# Altium project Telliskivi2014MainBoard.PrjPcb
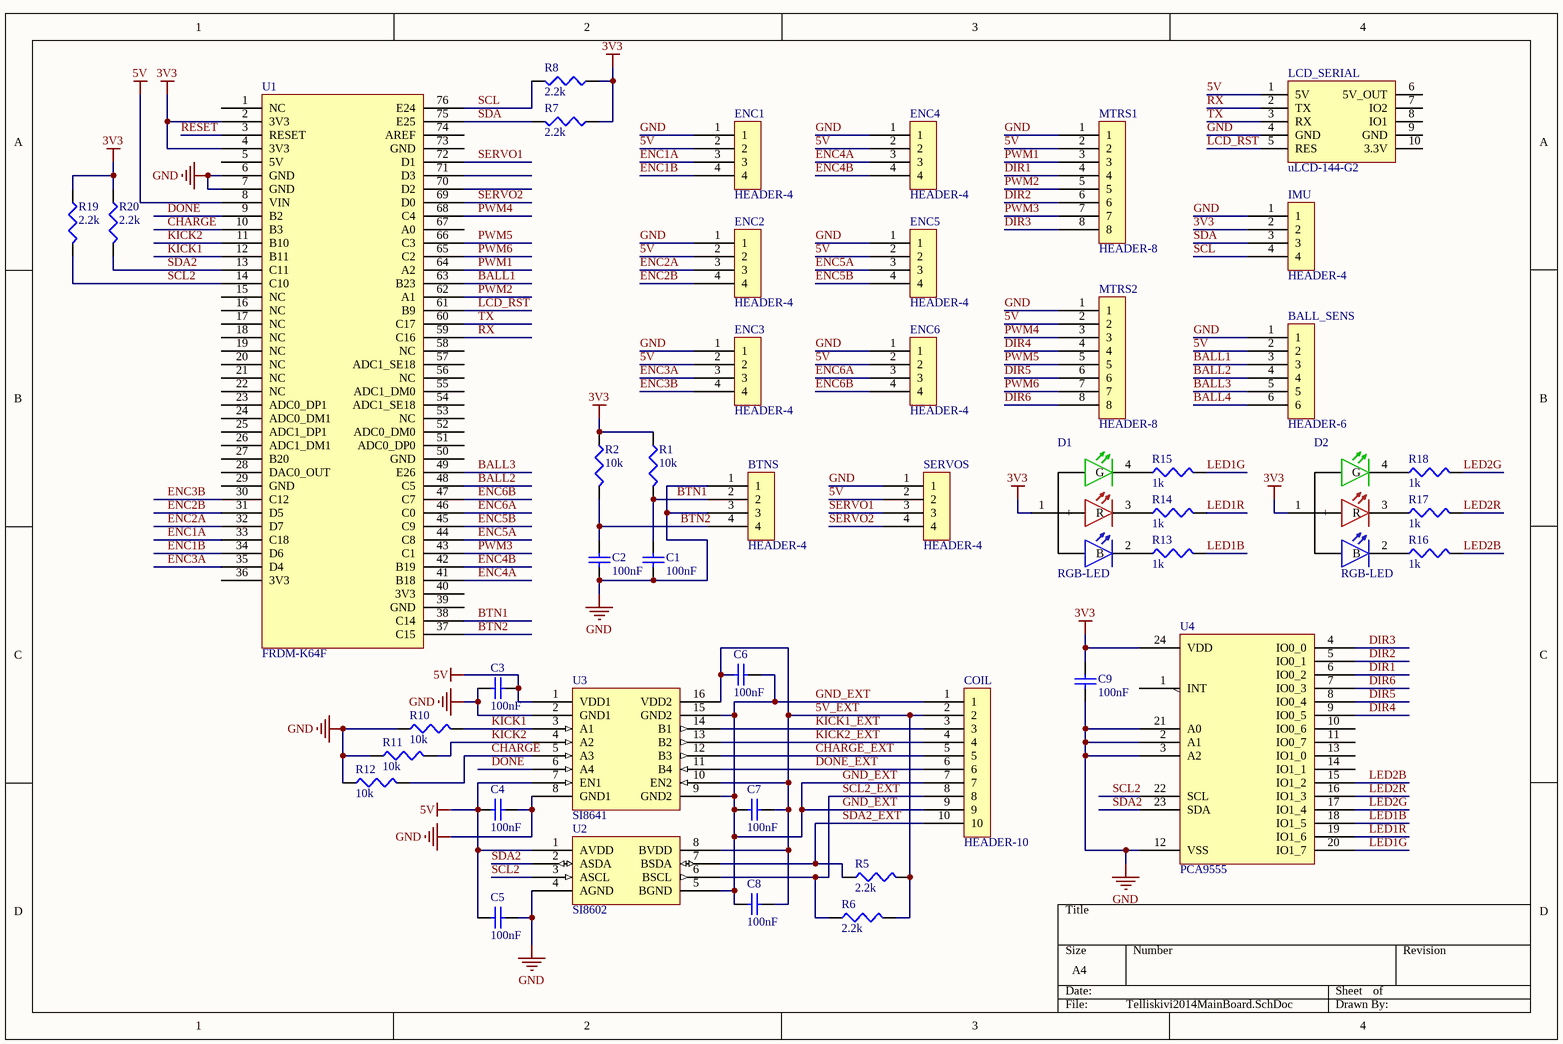
[diagram p0: Telliskivi2014MainBoard.SchDoc]
2 sheets, 60 parts. Net scope: global (net labels, ports and power ports of the same name join across sheets).
Board file: Telliskivi2014MainBoard.PcbDoc
Sheets:
  Telliskivi2014MainBoard.SchDoc
  Telliskivi2014MainBoardPower.SchDoc

## Sheet Telliskivi2014MainBoard.SchDoc
size A4

### Parts
BALL_SENS  HEADER-6  [MICRO-MATCH-6]
BTNS  HEADER-4  [MICRO-MATCH-4]
C1  100nF  [1608[0603]]
C2  100nF  [1608[0603]]
C3  100nF  [1608[0603]]
C4  100nF  [1608[0603]]
C5  100nF  [1608[0603]]
C6  100nF  [1608[0603]]
C7  100nF  [1608[0603]]
C8  100nF  [1608[0603]]
C9  100nF  [1608[0603]]
COIL  HEADER-10  [MICRO-MATCH-10]
D1  RGB-LED  [RGB-LED]
D2  RGB-LED  [RGB-LED]
ENC1  HEADER-4  [MICRO-MATCH-4]
ENC2  HEADER-4  [MICRO-MATCH-4]
ENC3  HEADER-4  [MICRO-MATCH-4]
ENC4  HEADER-4  [MICRO-MATCH-4]
ENC5  HEADER-4  [MICRO-MATCH-4]
ENC6  HEADER-4  [MICRO-MATCH-4]
IMU  HEADER-4  [MICRO-MATCH-4]
LCD_SERIAL  uLCD-144-G2  [uLCD-144-G2-NO-OVERLAY]
MTRS1  HEADER-8  [MICRO-MATCH-8]
MTRS2  HEADER-8  [MICRO-MATCH-8]
R1  10k  [J1-0603]
R2  10k  [J1-0603]
R5  2.2k  [J1-0603]
R6  2.2k  [J1-0603]
R7  2.2k  [J1-0603]
R8  2.2k  [J1-0603]
R10  10k  [J1-0603]
R11  10k  [J1-0603]
R12  10k  [J1-0603]
R13  1k  [J1-0603]
R14  1k  [J1-0603]
R15  1k  [J1-0603]
R16  1k  [J1-0603]
R17  1k  [J1-0603]
R18  1k  [J1-0603]
R19  2.2k  [J1-0603]
R20  2.2k  [J1-0603]
SERVOS  HEADER-4  [MICRO-MATCH-4]
U1  FRDM-K64F  [FRDM-K64F-SMT-NO-OVERLAY]
U2  SI8602  [SOIC8]
U3  SI8641  [SOIC16]
U4  PCA9555  [TSSOP24]

### Nets
3V3: C9.2 D1.1(+) D2.1(+) IMU.2 R1.1 R2.1 R7.1 R8.1 R19.1 R20.1 U1.2(3V3) U1.4(3V3) U4.24(VDD)
5V: BALL_SENS.2 C3.2 C4.1 C5.1 ENC1.2 ENC2.2 ENC3.2 ENC4.2 ENC5.2 ENC6.2 LCD_SERIAL.1(5V) MTRS1.2 MTRS2.2 SERVOS.2 U1.8(VIN) U2.1(AVDD) U3.1(VDD1) U3.7(EN1)
GND: BALL_SENS.1 BTNS.1 BTNS.3 C1.1 C2.1 C3.1 C4.2 C5.2 C9.1 ENC1.1 ENC2.1 ENC3.1 ENC4.1 ENC5.1 ENC6.1 IMU.1 LCD_SERIAL.4(GND) MTRS1.1 MTRS2.1 R10.1 R11.1 R12.1 SERVOS.1 U1.6(GND) U1.7(GND) U2.4(AGND) U3.2(GND1) U3.8(GND1) U4.2(A1) U4.3(A2) U4.12(VSS) U4.21(A0)
5V_EXT: C6.1 C7.2 C8.2 COIL.2 R5.2 R6.2 U2.8(BVDD) U3.10(EN2) U3.16(VDD2)
BALL1: BALL_SENS.3 U1.63(B23)
BALL2: BALL_SENS.4 U1.48(C5)
BALL3: BALL_SENS.5 U1.49(E26)
BALL4: BALL_SENS.6
BTN1: BTNS.2 C1.2 R1.2 U1.38(C14)
BTN2: BTNS.4 C2.2 R2.2 U1.37(C15)
CHARGE: R12.2 U1.10(B3) U3.5(A3)
CHARGE_EXT: COIL.5 U3.12(B3)
DIR1: MTRS1.4 U4.6(IO0_2)
DIR2: MTRS1.6 U4.5(IO0_1)
DIR3: MTRS1.8 U4.4(IO0_0)
DIR4: MTRS2.4 U4.9(IO0_5)
DIR5: MTRS2.6 U4.8(IO0_4)
DIR6: MTRS2.8 U4.7(IO0_3)
DONE: U1.9(B2) U3.6(A4)
DONE_EXT: COIL.6 U3.11(B4)
ENC1A: ENC1.3 U1.33(C18)
ENC1B: ENC1.4 U1.34(D6)
ENC2A: ENC2.3 U1.32(D7)
ENC2B: ENC2.4 U1.31(D5)
ENC3A: ENC3.3 U1.35(D4)
ENC3B: ENC3.4 U1.30(C12)
ENC4A: ENC4.3 U1.41(B18)
ENC4B: ENC4.4 U1.42(B19)
ENC5A: ENC5.3 U1.44(C8)
ENC5B: ENC5.4 U1.45(C9)
ENC6A: ENC6.3 U1.46(C0)
ENC6B: ENC6.4 U1.47(C7)
GND_EXT: C6.2 C7.1 C8.1 COIL.1 COIL.7 COIL.9 U2.5(BGND) U3.9(GND2) U3.15(GND2)
KICK1: R10.2 U1.12(B11) U3.3(A1)
KICK1_EXT: COIL.3 U3.14(B1)
KICK2: R11.2 U1.11(B10) U3.4(A2)
KICK2_EXT: COIL.4 U3.13(B2)
LCD_RST: LCD_SERIAL.5(RES) U1.61(B9)
LED1B: R13.2 U4.18(IO1_5)
LED1G: R15.2 U4.20(IO1_7)
LED1R: R14.2 U4.19(IO1_6)
LED2B: R16.2 U4.15(IO1_2)
LED2G: R18.2 U4.17(IO1_4)
LED2R: R17.2 U4.16(IO1_3)
PWM1: MTRS1.3 U1.64(A2)
PWM2: MTRS1.5 U1.62(A1)
PWM3: MTRS1.7 U1.43(C1)
PWM4: MTRS2.3 U1.68(C4)
PWM5: MTRS2.5 U1.66(C3)
PWM6: MTRS2.7 U1.65(C2)
RESET: U1.3(RESET)
RX: LCD_SERIAL.2(TX) U1.59(C16)
SCL: IMU.4 R8.2 U1.76(E24)
SCL2: R19.2 U1.14(C10) U2.3(ASCL) U4.22(SCL)
SCL2_EXT: COIL.8 R6.1 U2.6(BSCL)
SDA: IMU.3 R7.2 U1.75(E25)
SDA2: R20.2 U1.13(C11) U2.2(ASDA) U4.23(SDA)
SDA2_EXT: COIL.10 R5.1 U2.7(BSDA)
SERVO1: SERVOS.3 U1.72(D1)
SERVO2: SERVOS.4 U1.69(D0)
TX: LCD_SERIAL.3(RX) U1.60(C17)
NetD1_2: D1.2(B) R13.1
NetD1_3: D1.3(R) R14.1
NetD1_4: D1.4(G) R15.1
NetD2_2: D2.2(B) R16.1
NetD2_3: D2.3(R) R17.1
NetD2_4: D2.4(G) R18.1

Not connected (* = marked no-connect by the designer): LCD_SERIAL 6(5V_OUT) 7(IO2) 8(IO1) 9(GND) 10(3.3V); U1 1(NC) 5(5V) 15(NC) 16(NC) 17(NC) 18(NC) 19(NC) 20(NC) 21(NC) 22(NC) 23(ADC0_DP1) 24(ADC0_DM1) 25(ADC1_DP1) 26(ADC1_DM1) 27(B20) 28(DAC0_OUT) 29(GND) 36(3V3) 39(GND) 40(3V3) 50(GND) 51(ADC0_DP0) 52(ADC0_DM0) 53(NC) 54(ADC1_SE18) 55(ADC1_DM0) 56(NC) 57(ADC1_SE18) 58(NC) 67(A0) 70(D2) 71(D3) 73(GND) 74(AREF); U4 1(INT) 10(IO0_6) 11(IO0_7) 13(IO1_0) 14(IO1_1)

### Library data of the parts
C1-C9 = Cap Semi: Capacitor (Semiconductor SIM Model); Value: 100pF; Published: 8-Jun-2000; LatestRevisionDate: 29-May-2009; LatestRevisionNote: IPC-7351 Footprint Added.; PackageReference: C1206; Publisher: Altium Limited; PackageDescription: Chip Capacitor
R1 R2 R5-R8 R10-R12 R19 R20 = Res3: Resistor; Value: 1K; Published: 8-Jun-2000; LatestRevisionDate: 29-May-2009; LatestRevisionNote: IPC-7351 Footprint Added.; PackageReference: J1-0603; Publisher: Altium Limited; PackageDescription: Chip Resistor
R13-R18 = Res3: Resistor; Published: 8-Jun-2000; LatestRevisionDate: 29-May-2009; LatestRevisionNote: IPC-7351 Footprint Added.; PackageReference: J1-0603; Publisher: Altium Limited; PackageDescription: Chip Resistor; Value: 1K

## Sheet Telliskivi2014MainBoardPower.SchDoc
size A4
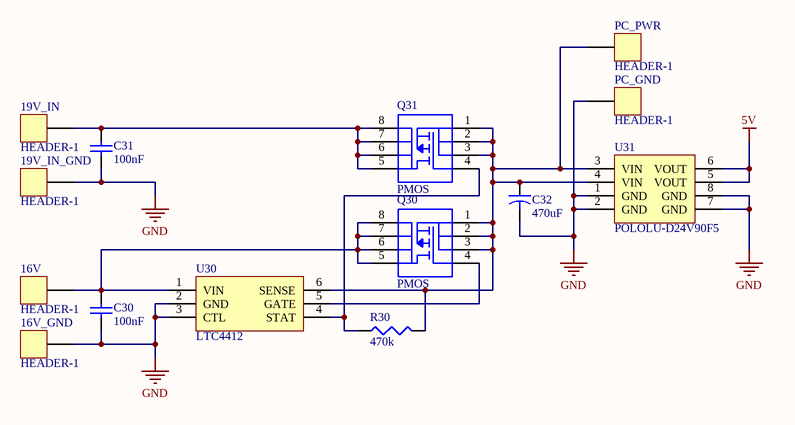
[diagram p1: Telliskivi2014MainBoardPower.SchDoc]

### Parts
16V  HEADER-1  [POWER-VIA]
16V_GND  HEADER-1  [POWER-VIA]
19V_IN  HEADER-1  [POWER-VIA]
19V_IN_GND  HEADER-1  [POWER-VIA]
C30  100nF  [1608[0603]]
C31  100nF  [1608[0603]]
C32  470uF  [CAPR5-4X5]
PC_GND  HEADER-1  [POWER-VIA]
PC_PWR  HEADER-1  [POWER-VIA]
Q30  PMOS  [SO8]
Q31  PMOS  [SO8]
R30  470k  [J1-0603]
U30  LTC4412  [TSOT-23-6]
U31  POLOLU-D24V90F5  [POLOLU-D24V90F5-NO-OUTLINE]

### Nets
5V: U31.5(VOUT) U31.6(VOUT)
GND: 16V_GND.1 19V_IN_GND.1 C30.2 C31.2 C32.2 PC_GND.1 U30.2(GND) U30.3(CTL) U31.1(GND) U31.2(GND) U31.7(GND) U31.8(GND)
Net16V_1: 16V.1 C30.1 Q30.5 Q30.6 Q30.7 Q30.8 U30.1(VIN)
Net19V_IN_1: 19V_IN.1 C31.1 Q31.5 Q31.6 Q31.7 Q31.8
NetC32_1: C32.1 PC_PWR.1 Q30.1 Q30.2 Q30.3 Q31.1 Q31.2 Q31.3 R30.2 U30.6(SENSE) U31.3(VIN) U31.4(VIN)
NetQ30_4: Q30.4 U30.5(GATE)
NetQ31_4: Q31.4 R30.1 U30.4(STAT)

### Library data of the parts
C30 C31 = Cap Semi: as C1 on sheet Telliskivi2014MainBoard; Published: 8-Jun-2000; LatestRevisionDate: 29-May-2009; LatestRevisionNote: IPC-7351 Footprint Added.; PackageReference: C1206; Publisher: Altium Limited; PackageDescription: Chip Capacitor
C32 = Cap2: Capacitor; Value: 100pF; Published: 23-Sep-2002; PackageReference: CAPR5-4X5; Publisher: Altium Limited; PackageDescription: Capacitor; 2 Leads
R30 = Res3: Resistor; Value: 1K; Published: 8-Jun-2000; LatestRevisionDate: 29-May-2009; LatestRevisionNote: IPC-7351 Footprint Added.; PackageReference: J1-0603; Publisher: Altium Limited; PackageDescription: Chip Resistor

## Nets that join several sheets
5V: Telliskivi2014MainBoard (18 pins), Telliskivi2014MainBoardPower (U31.5 U31.6)
GND: Telliskivi2014MainBoard (32 pins), Telliskivi2014MainBoardPower (12 pins)